# EAGLE schematic CANAvionics (EAGLE 6.3)
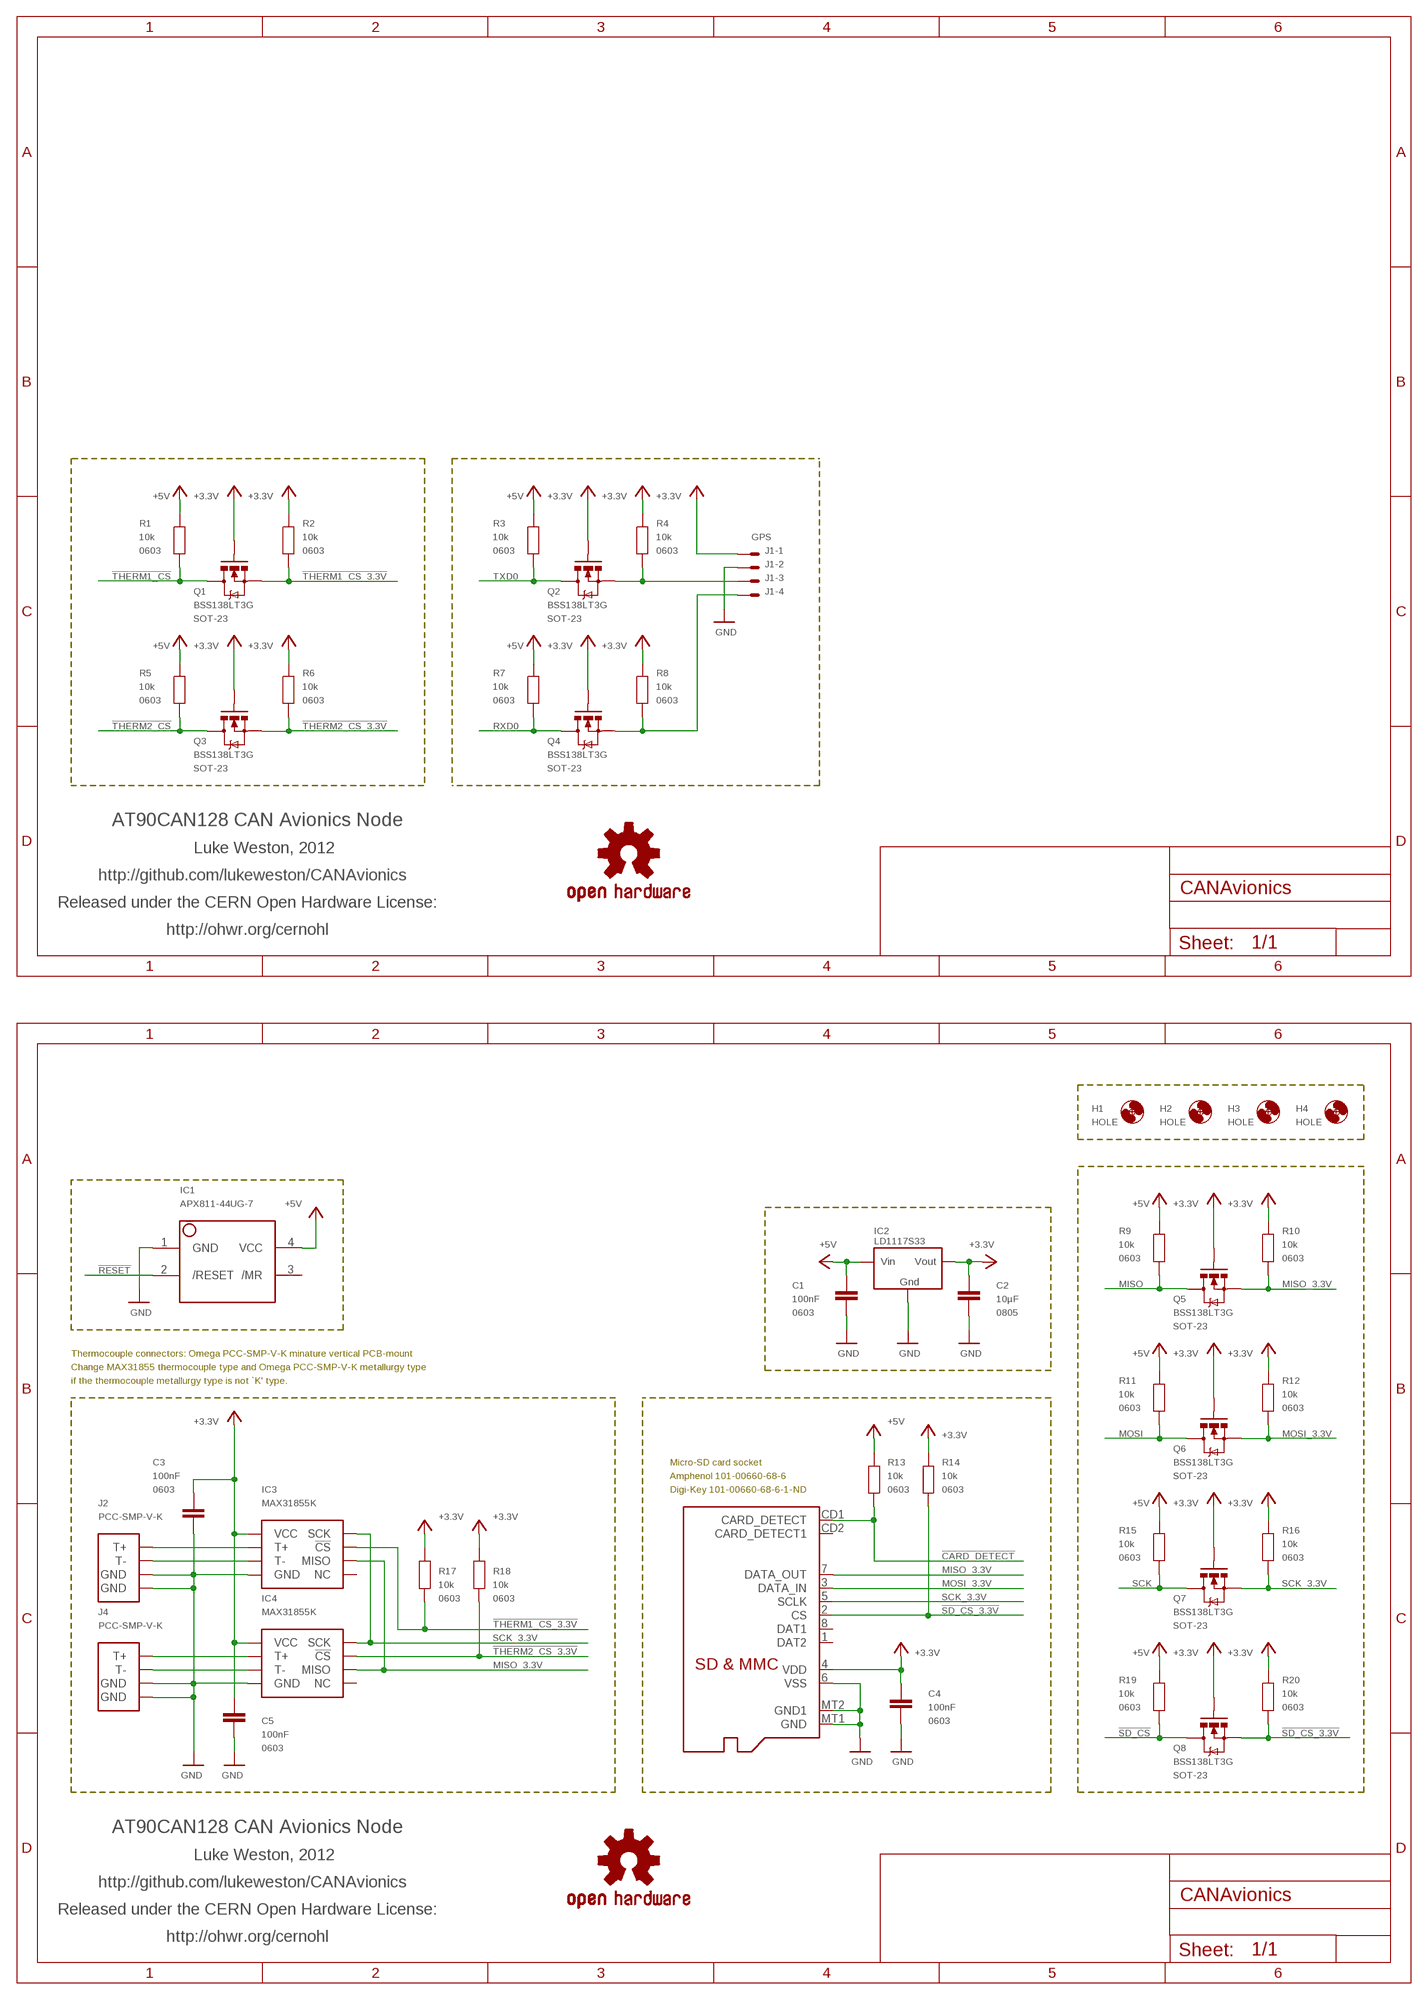
[diagram p0: schematic, sheet 1, part 1 of 2]
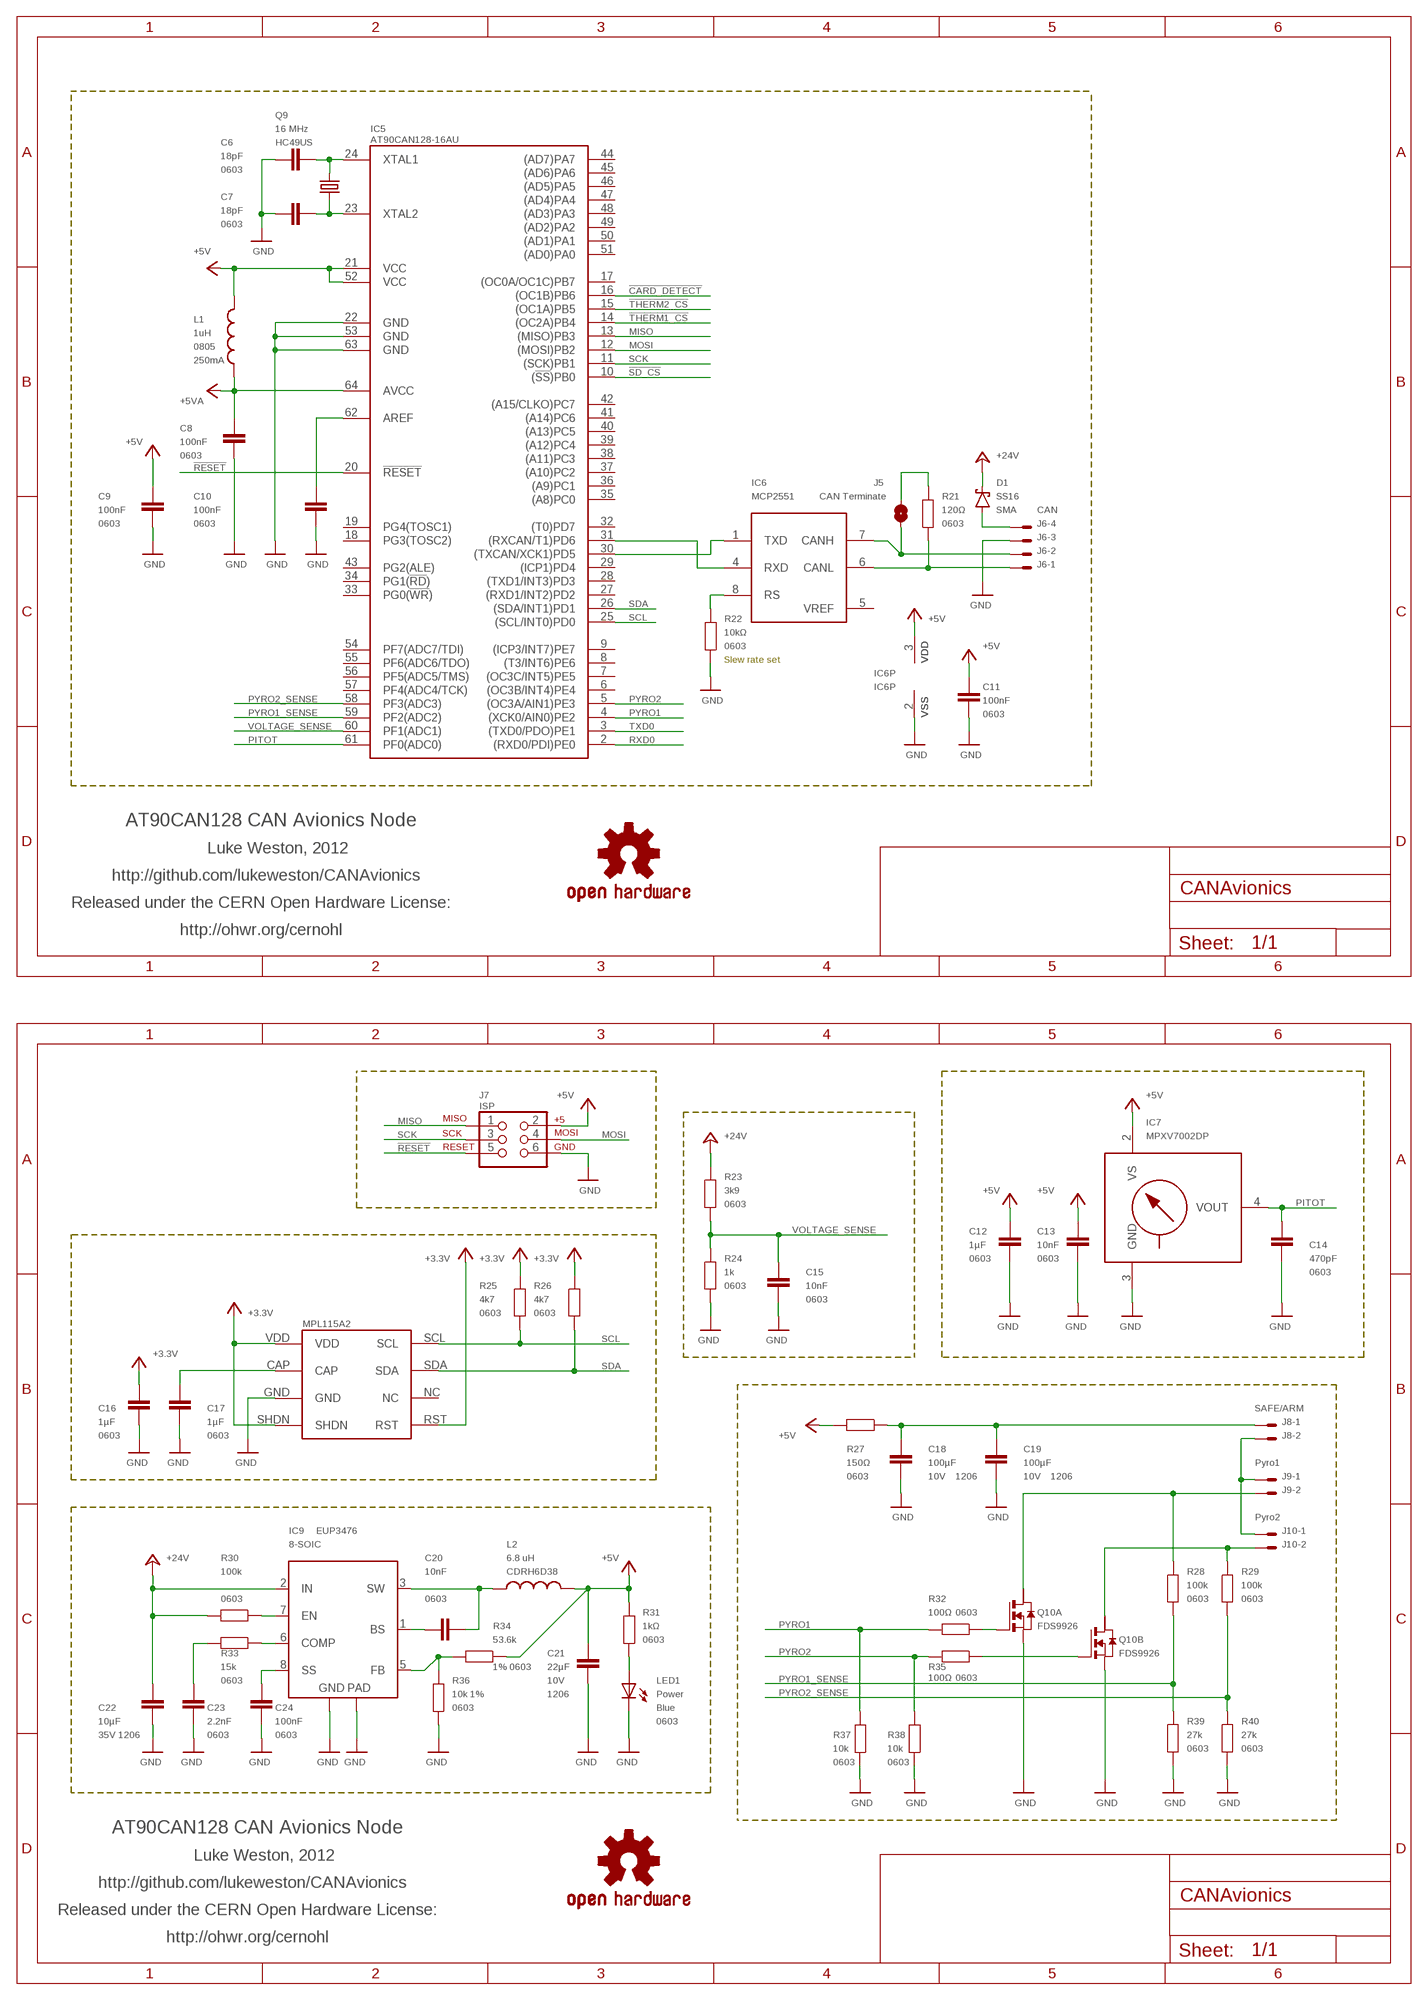
[diagram p1: schematic, sheet 1, part 2 of 2]

## Parts
C1  100nF  CAP0603  [0603]
C2  10µF  CAP0805  [0805]
C3  100nF  CAP0603  [0603]
C4  100nF  CAP0603  [0603]
C5  100nF  CAP0603  [0603]
C6  18pF  CAP0603  [0603]
C7  18pF  CAP0603  [0603]
C8  100nF  CAP0603  [0603]
C9  100nF  CAP0603  [0603]
C10  100nF  CAP0603  [0603]
C11  100nF  CAP0603  [0603]
C12  1µF  CAP0603  [0603]
C13  10nF  CAP0603  [0603]
C14  470pF  CAP0603  [0603]
C15  10nF  CAP0603  [0603]
C16  1µF  CAP0603  [0603]
C17  1µF  CAP0603  [0603]
C18  100µF  C-EUC1206K  [C1206K]
C19  100µF  C-EUC1206K  [C1206K]
C20  10nF  CAP0603  [0603]
C21  22µF  C-EUC1206K  [C1206K]
C22  10µF  C-EUC1206K  [C1206K]
C23  2.2nF  CAP0603  [0603]
C24  100nF  CAP0603  [0603]
D1  SS16  SCHOTTKY  [SMA]
H1  HOLE  MOUNT-HOLE3.2  [3,2]
H2  HOLE  MOUNT-HOLE3.2  [3,2]
H3  HOLE  MOUNT-HOLE3.2  [3,2]
H4  HOLE  MOUNT-HOLE3.2  [3,2]
IC1  APX811-44UG-7  APX81X-RESET-IC  [SOT143-R]
IC2  LD1117S33  REG1117  [SOT223]
IC3  MAX31855K  MCLENG_MAX6675MAX31855  [MCLENG_SOIC-8]
IC4  MAX31855K  MCLENG_MAX6675MAX31855  [MCLENG_SOIC-8]
IC5  AT90CAN128-16AU  [TQFP64-0.8MM]
IC6  MCP2551  MCP2551SN  [SO-08]
IC7  MPXV7002DP  MPXV5004GDP  [1351]
IC8  MPL115A  [MPL115A]
IC9  EUP3476  [SO08T]
J1  GPS  22-05-7048-04  [7395-04]
J2  PCC-SMP-V-K  MCLAUGHLINENG_TC_JACK  [MCLAUGHLINENG_TC_JACK]
J3  MicroSD Card  ADAFRUIT_MICROSD  [ADAFRUIT_MICROSD]
J4  PCC-SMP-V-K  MCLAUGHLINENG_TC_JACK  [MCLAUGHLINENG_TC_JACK]
J5  CAN Terminate  SJ  [SJ]
J6  CAN  22-05-7048-04  [7395-04]
J7  ISP  AVR_SPI_PRG_6PTH  [2X3]
J8  SAFE/ARM  22-05-7028-02  [7395-02]
J9  Pyro1  22-05-7028-02  [7395-02]
J10  Pyro2  22-05-7028-02  [7395-02]
L1  1uH  L-USL2012C  [L2012C]
L2  6.8 uH  INDUCTOR  [CDRH]
LED1  Power  LED0603  [LED-0603]
Q1  BSS138LT3G  MOSFET-NCHANNELSMD  [SOT23-3]
Q2  BSS138LT3G  MOSFET-NCHANNELSMD  [SOT23-3]
Q3  BSS138LT3G  MOSFET-NCHANNELSMD  [SOT23-3]
Q4  BSS138LT3G  MOSFET-NCHANNELSMD  [SOT23-3]
Q5  BSS138LT3G  MOSFET-NCHANNELSMD  [SOT23-3]
Q6  BSS138LT3G  MOSFET-NCHANNELSMD  [SOT23-3]
Q7  BSS138LT3G  MOSFET-NCHANNELSMD  [SOT23-3]
Q8  BSS138LT3G  MOSFET-NCHANNELSMD  [SOT23-3]
Q9  16 MHz  CRYSTALHC49US  [HC49US]
Q10  FDS9926  NMOS2SM8  [SM8]
R1  10k  RESISTOR0603  [0603]
R2  10k  RESISTOR0603  [0603]
R3  10k  RESISTOR0603  [0603]
R4  10k  RESISTOR0603  [0603]
R5  10k  RESISTOR0603  [0603]
R6  10k  RESISTOR0603  [0603]
R7  10k  RESISTOR0603  [0603]
R8  10k  RESISTOR0603  [0603]
R9  10k  RESISTOR0603  [0603]
R10  10k  RESISTOR0603  [0603]
R11  10k  RESISTOR0603  [0603]
R12  10k  RESISTOR0603  [0603]
R13  10k  RESISTOR0603  [0603]
R14  10k  RESISTOR0603  [0603]
R15  10k  RESISTOR0603  [0603]
R16  10k  RESISTOR0603  [0603]
R17  10k  RESISTOR0603  [0603]
R18  10k  RESISTOR0603  [0603]
R19  10k  RESISTOR0603  [0603]
R20  10k  RESISTOR0603  [0603]
R21  120Ω  RESISTOR0603  [0603]
R22  10kΩ  RESISTOR0603  [0603]
R23  3k9  RESISTOR0603  [0603]
R24  1k  RESISTOR0603  [0603]
R25  4k7  RESISTOR0603  [0603]
R26  4k7  RESISTOR0603  [0603]
R27  150Ω  RESISTOR0603  [0603]
R28  100k  RESISTOR0603  [0603]
R29  100k  RESISTOR0603  [0603]
R30  100k  RESISTOR0603  [0603]
R31  1kΩ  RESISTOR0603  [0603]
R32  100Ω  RESISTOR0603  [0603]
R33  15k  RESISTOR0603  [0603]
R34  53.6k  RESISTOR0603  [0603]
R35  100Ω  RESISTOR0603  [0603]
R36  10k 1%  RESISTOR0603  [0603]
R37  10k  RESISTOR0603  [0603]
R38  10k  RESISTOR0603  [0603]
R39  27k  RESISTOR0603  [0603]
R40  27k  RESISTOR0603  [0603]
SY1  OSHW-LOGOS  [OSHW-LOGO-S]
SY2  OSHW-LOGOS  [OSHW-LOGO-S]
SY3  OSHW-LOGOS  [OSHW-LOGO-S]
SY4  OSHW-LOGOS  [OSHW-LOGO-S]

## Nets
!CARD_DETECT: IC5.16((OC1B)PB6) J3.CD1(CARD_DETECT) R13.2
!RESET: IC1.2(/RESET) IC5.20(!RESET) J7.5
!SD_CS: IC5.10((!SS!)PB0) Q8.3(D) R19.1
!SD_CS_3.3V: J3.2(CS) Q8.2(S) R14.2 R20.1
!THERM1_CS: IC5.14((OC2A)PB4) Q1.3(D) R1.1
!THERM1_CS_3.3V: IC3.CS(!CS) Q1.2(S) R2.1 R17.2
!THERM2_CS: IC5.15((OC1A)PB5) Q3.3(D) R5.1
!THERM2_CS_3.3V: IC4.CS(!CS) Q3.2(S) R6.1 R18.2
+3V3: C2.2 C3.2 C4.2 C5.1 C16.2 IC2.2(VOUT) IC3.VCC IC4.VCC IC8.RST IC8.SHDN IC8.VDD J1.1 J3.4(VDD) Q1.1(G) Q2.1(G) Q3.1(G) Q4.1(G) Q5.1(G) Q6.1(G) Q7.1(G) Q8.1(G) R2.2 R4.2 R6.2 R8.2 R10.2 R12.2 R14.1 R16.2 R17.1 R18.1 R20.2 R25.2 R26.2 ; supply symbol labelled +3.3V
+5V: C1.2 C9.2 C11.2 C12.2 C13.2 C21.1 IC1.4(VCC) IC2.3(VIN) IC5.21(VCC) IC5.52(VCC) IC6.3(VDD) IC7.2(VS) J7.2 L1.1 L2.2 R1.2 R3.2 R5.2 R7.2 R9.2 R11.2 R13.1 R15.2 R19.2 R27.2 R31.1 R34.1
+5VA: C8.2 IC5.64(AVCC) L1.2
+24V: C22.1 D1.K IC9.2(IN) R23.2 R30.2
CANH: IC6.7(CANH) J5.2 J6.2
CANL: IC6.6(CANL) J6.1 R21.1
GND: C1.1 C2.1 C3.1 C4.1 C5.2 C6.1 C7.1 C8.1 C9.1 C10.1 C11.1 C12.1 C13.1 C14.1 C15.1 C16.1 C17.1 C18.1 C19.1 C21.2 C22.2 C23.1 C24.1 IC1.1(GND) IC2.1(GND) IC3.GND IC4.GND IC5.22(GND) IC5.53(GND) IC5.63(GND) IC6.2(VSS) IC7.3(GND) IC8.GND IC9.4(GND) IC9.9(TGND) J1.2 J2.P$1(GND) J2.P$2(GND) J3.6(VSS) J3.MT1(GND) J3.MT2(GND1) J4.P$1(GND) J4.P$2(GND) J6.3 J7.6 LED1.C Q10.1(B:S) Q10.3(A:S) R22.2 R24.1 R36.2 R37.2 R38.2 R39.1 R40.1
GPS_RXD: J1.3 Q2.2(S) R4.1
GPS_TXD: J1.4 Q4.2(S) R8.1
MISO: IC5.13((MISO)PB3) J7.1 Q5.3(D) R9.1
MISO_3.3V: IC3.SO(MISO) IC4.SO(MISO) J3.7(DATA_OUT) Q5.2(S) R10.1
MOSI: IC5.12((MOSI)PB2) J7.4 Q6.3(D) R11.1
MOSI_3.3V: J3.3(DATA_IN) Q6.2(S) R12.1
N$1: C17.2 IC8.CAP
N$2: J10.2 Q10.7(B:D) R29.2
N$3: J9.2 Q10.5(A:D) R28.2
N$4: Q10.4(A:G) R32.1
N$5: Q10.2(B:G) R35.1
N$6: IC5.31((RXCAN/T1)PD6) IC6.4(RXD)
N$7: IC5.30((TXCAN/XCK1)PD5) IC6.1(TXD)
N$8: J8.2 J9.1 J10.1
N$9: LED1.A R31.2
N$10: C18.2 C19.2 J8.1 R27.1
N$11: C10.2 IC5.62(AREF)
N$18: C6.2 IC5.24(XTAL1) Q9.2
N$19: C7.2 IC5.23(XTAL2) Q9.1
N$28: IC4.T- J4.T-
N$29: IC4.T+ J4.T+
N$30: D1.A J6.4
N$31: J5.1 R21.2
N$32: IC3.T- J2.T-
N$33: IC3.T+ J2.T+
N$42: IC9.7(EN) R30.1
N$44: C20.1 IC9.3(SW) L2.1
N$51: C20.2 IC9.1(BS)
N$59: C23.2 R33.2
N$61: IC9.6(COMP) R33.1
N$62: C24.2 IC9.8(SS)
N$63: IC9.5(FB) R34.2 R36.1
N$87: IC6.8(RS) R22.1
PITOT: C14.2 IC5.61(PF0(ADC0)) IC7.4(VOUT)
PYRO1: IC5.4((XCK0/AIN0)PE2) R32.2 R37.1
PYRO1_SENSE: IC5.59(PF2(ADC2)) R28.1 R39.2
PYRO2: IC5.5((OC3A/AIN1)PE3) R35.2 R38.1
PYRO2_SENSE: IC5.58(PF3(ADC3)) R29.1 R40.2
RXD0: IC5.2((RXD0/PDI)PE0) Q4.3(D) R7.1
SCK: IC5.11((SCK)PB1) J7.3 Q7.3(D) R15.1
SCK_3.3V: IC3.SCK IC4.SCK J3.5(SCLK) Q7.2(S) R16.1
SCL: IC5.25((SCL/INT0)PD0) IC8.SCL R25.1
SDA: IC5.26((SDA/INT1)PD1) IC8.SDA R26.1
TXD0: IC5.3((TXD0/PDO)PE1) Q2.3(D) R3.1
VOLTAGE_SENSE: C15.2 IC5.60(PF1(ADC1)) R23.1 R24.2
Unconnected: IC1.3(/MR) IC3.NC IC4.NC IC5.6((OC3B/INT4)PE4) IC5.7((OC3C/INT5)PE5) IC5.8((T3/INT6)PE6) IC5.9((ICP3/INT7)PE7) IC5.17((OC0A/OC1C)PB7) IC5.18(PG3(TOSC2)) IC5.19(PG4(TOSC1)) IC5.27((RXD1/INT2)PD2) IC5.28((TXD1/INT3)PD3) IC5.29((ICP1)PD4) IC5.32((T0)PD7) IC5.33(PG0(!WR!)) IC5.34(PG1(!RD!)) IC5.35((A8)PC0) IC5.36((A9)PC1) IC5.37((A10)PC2) IC5.38((A11)PC3) IC5.39((A12)PC4) IC5.40((A13)PC5) IC5.41((A14)PC6) IC5.42((A15/CLKO)PC7) IC5.43(PG2(ALE)) IC5.44((AD7)PA7) IC5.45((AD6)PA6) IC5.46((AD5)PA5) IC5.47((AD4)PA4) IC5.48((AD3)PA3) IC5.49((AD2)PA2) IC5.50((AD1)PA1) IC5.51((AD0)PA0) IC5.54(PF7(ADC7/TDI)) IC5.55(PF6(ADC6/TDO)) IC5.56(PF5(ADC5/TMS)) IC5.57(PF4(ADC4/TCK)) IC7.1(NC) IC7.5(NC) IC7.6(NC) IC8.NC J3.1(DAT2) J3.8(DAT1) J3.CD2(CARD_DETECT1) Q10.6(A:D2) Q10.8(B:D2)

## Notes on the sheet
- AT90CAN128 CAN Avionics Node
- Luke Weston, 2012
- http://github.com/lukeweston/CANAvionics
- Released under the CERN Open Hardware License:
- http://ohwr.org/cernohl
- Thermocouple connectors: Omega PCC-SMP-V-K minature vertical PCB-mount
- Change MAX31855 thermocouple type and Omega PCC-SMP-V-K metallurgy type
- if the thermocouple metallurgy type is not `K' type.
- Micro-SD card socket
- Amphenol 101-00660-68-6
- Digi-Key 101-00660-68-6-1-ND
- AT90CAN128 CAN Avionics Node
- Luke Weston, 2012
- http://github.com/lukeweston/CANAvionics
- Released under the CERN Open Hardware License:
- http://ohwr.org/cernohl
- Slew rate set
- AT90CAN128 CAN Avionics Node
- Luke Weston, 2012
- http://github.com/lukeweston/CANAvionics
- Released under the CERN Open Hardware License:
- http://ohwr.org/cernohl
- MPL115A2
- AT90CAN128 CAN Avionics Node
- Luke Weston, 2012
- http://github.com/lukeweston/CANAvionics
- Released under the CERN Open Hardware License:
- http://ohwr.org/cernohl

## Power pins joined to a net without a drawn wire
VREF: IC6.5(VREF)

## Library data of the parts
C1 C3-C17 C20 C23 C24 = freetronics-master-v1:CAP: Capacitor Standard 0603 ceramic capacitor, and 0.1" leaded capacitor.; PACKAGE: 0603
C2 = freetronics-master-v1:CAP: Capacitor Standard 0603 ceramic capacitor, and 0.1" leaded capacitor.; PACKAGE: 0805
C18 C19 = rcl:C-EU: CAPACITOR, European symbol; PACKAGE: 1206; VOLTAGE: 10V
C21 = freetronics-jon:C-EU: CAPACITOR, European symbol; PACKAGE: 1206; VOLTAGE: 10V
C22 = freetronics-jon:C-EU: CAPACITOR, European symbol; VOLTAGE: 35V 1206
D1 = freetronics-luke:SCHOTTKY; PACKAGE: SMA
H1-H4 = holes:MOUNT-HOLE: MOUNTING HOLE with drill center marker
IC1 = freetronics-master-v1:APX81X-RESET-IC
IC2 = burr-brown:REG1117: 800mA and 1A Low Dropout (LDO) Positive Regulator 1.8V, 2.5V, 2.85V, 3.3V, 5V, and Adj; MPN: REG1117; OC_FARNELL: 1097566; OC_NEWARK: 14P6981
IC3 IC4 = RAMPSdisplay:MCLENG_MAX6675
IC5 = _hhn_at90can32_64_128_v2:AT90CAN*: ATMEL AVR AT90CAN32-..A. / 64-..A. / 128-..A., TQFP64 with 0.8mm pad spacing (Atmel Package Code 'A2 64': 64-Lead, Thin 1.0 mm / 0.03937 in. Plastic Gull Wing Quad Flat Package) Ordering Code = Product Marking / Speed (MHz) / Power Supply (V) / Operation Range AT90CANx-16AI / 16 / 2.7 .. 5.5 / Industrial (-40 .. +85)°C AT90CANx-16AU / 16 / 2.7 .. 5.5 / Industrial Green (-40 .. +85)°C x = 32 / 64 / 128 (KB of ISP Flash Memory) Author: Dipl.-Ing. FH Rainer Bayer HHN Hochschule Heilbronn, rainer.bayer@hs-heilbronn.de Ingenieurbüro ing-rb, mail@ing-rb.de
IC6 = microchip_can:MCP2551: High Speed CAN tranceiver
IC7 = mpx-freescale:MPXV5004G: Integrated Silicon Pressure Sensor On-Chip Signal Conditioned, Temperature Compensated and Calibrated INTEGRATED PRESSURE SENSOR 0 TO 3.92 kPA (0 TO 400 mm H2O) 1.0 TO 4.9 V OUTPUT
IC8 = SparkFun:MPL115A
IC9 = freetronics-luke:EUP3476: EUTECH EUP3476 buck converter; PACKAGE: 8-SOIC
J1 J6 = con-molex:22-?-04: CONNECTOR wire to board 2.54 mm (.1 inch) pitch header; OC_FARNELL: unknown; OC_NEWARK: unknown
J2 J4 = RAMPSdisplay:MCLAUGHLINENG_TC_JACK
J3 = RAMPSdisplay:ADAFRUIT_MICROSD: Micro-SD / Transflash card holder with SPI pinout For the 3M # 2908-05WB-MG and/or 4UCON #19656 push-push type
J5 = freetronics-luke:SJ: PCB "solder jumper". Note that there should nothing on the BOM corresponding to this "component".
J7 = SparkFun:AVR_SPI_PRG_6: AVR ISP 6 Pin This is the reduced ISP connector for AVR programming. Common on Arduino. This footprint will take up less PCB space and can be used with a 10-pin to 6-pin adapter such as SKU: BOB-08508
J8-J10 = con-molex:22-?-02: CONNECTOR wire to board 2.54 mm (.1 inch) pitch header; OC_FARNELL: 9731601; OC_NEWARK: unknown
L1 = rcl:L-US: INDUCTOR, American symbol; CURRENT: 250mA; PACKAGE: 0805
L2 = freetronics-luke:INDUCTOR; PACKAGE: CDRH6D38
LED1 = freetronics-master-v1:LED: LEDs Standard schematic elements and footprints for 5mm, 3mm, 1206, and 0603 sized LEDs. 5mm - Spark Fun Electronics SKU : COM-00529 (and others); COLOUR: Blue; PACKAGE: 0603
Q1-Q8 = freetronics-master-v1.1:MOSFET-NCHANNEL; PACKAGE: SOT-23
Q9 = SparkFun:CRYSTAL: Crystals Various standard crystals. Proven footprints. Spark Fun Electronics SKU : COM-00534; PACKAGE: HC49US
Q10 = zetex:NMOS2SM8: Dual MOS FET; OC_FARNELL: unknown; OC_NEWARK: unknown
R1-R33 R35-R40 = freetronics-master-v1:RESISTOR: Resistor Basic schematic elements and footprints for 0603, 1206, and PTH 1/10th watt (small) resistors.; PACKAGE: 0603
R34 = freetronics-master-v1:RESISTOR: Resistor Basic schematic elements and footprints for 0603, 1206, and PTH 1/10th watt (small) resistors.; PACKAGE: 1% 0603
SY1-SY4 = SparkFun:OSHW-LOGO: Open Source Hardware Logo This logo indicates the piece of hardware it is found on incorporates a OSHW license and/or adheres to the definition of open source hardware found here: http://freedomdefined.org/OSHW